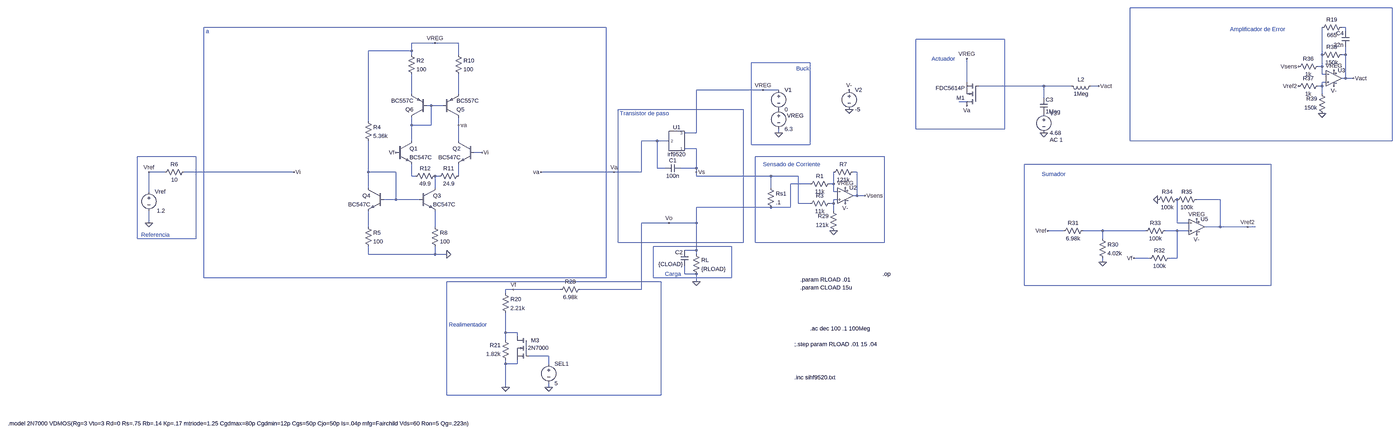
[diagram p0: schematic LDOB_compensadoI.asc, whole sheet]
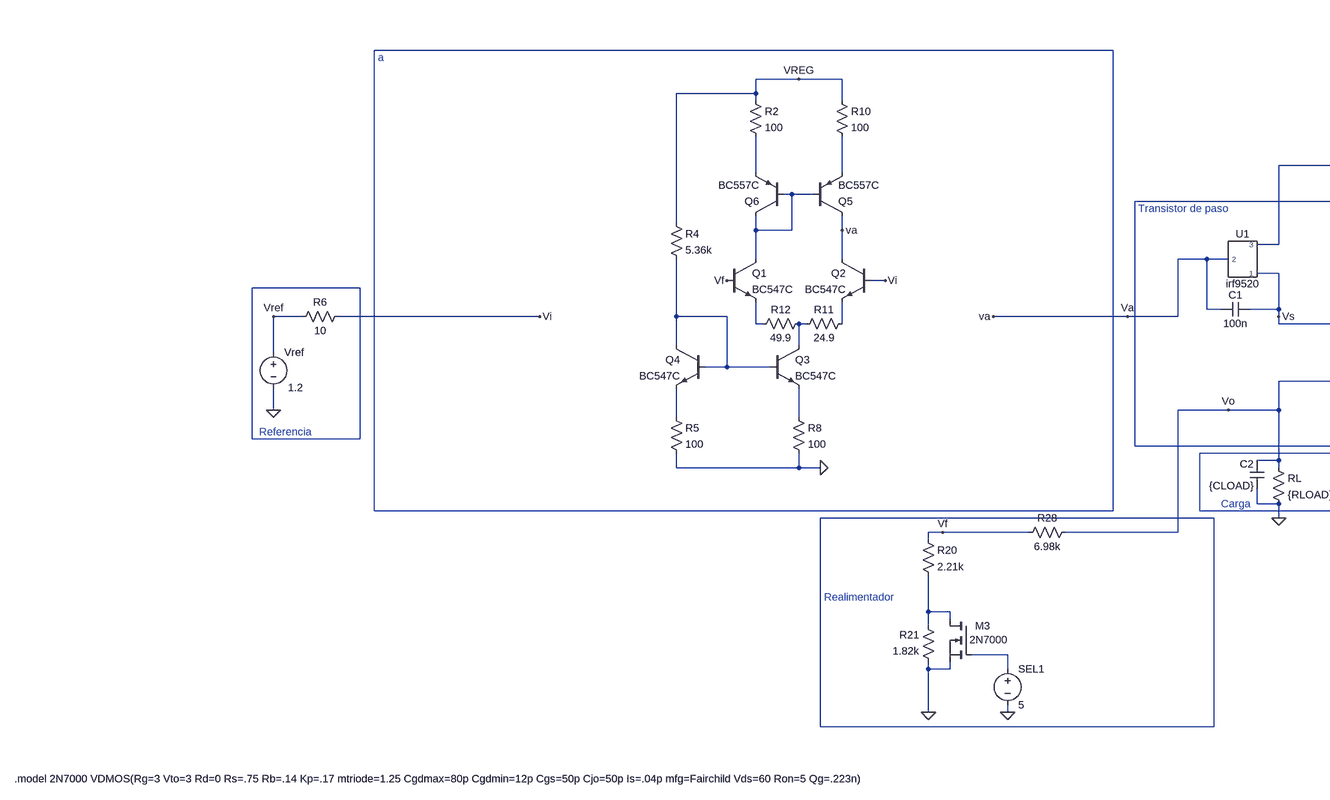
[diagram p1: schematic LDOB_compensadoI.asc, part, row 1 of 1, column 1 of 2]
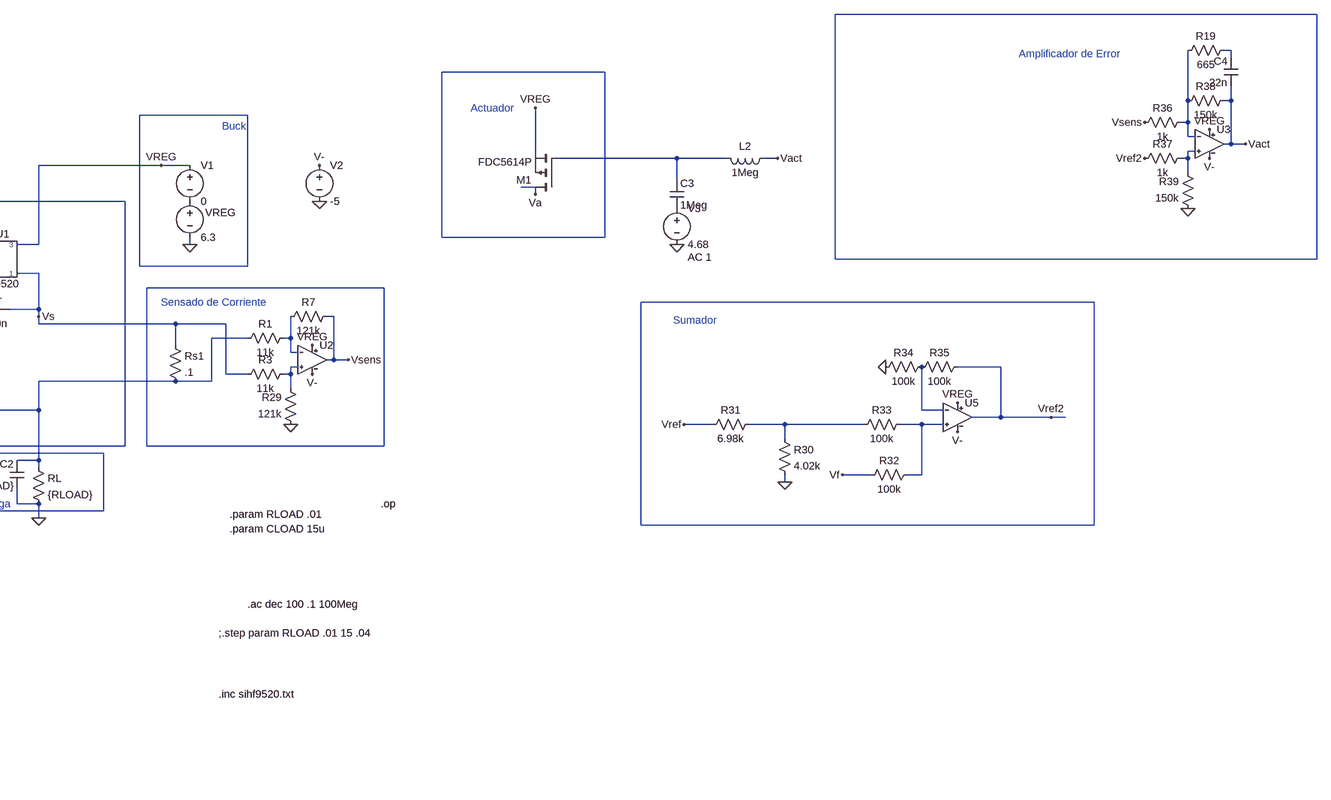
[diagram p2: schematic LDOB_compensadoI.asc, part, row 1 of 1, column 2 of 2]
LDOB_compensadoI.asc, the LTspice schematic file:
Version 4
SHEET 1 26844 1652
WIRE 4848 -560 3504 -560
WIRE 1264 -480 -512 -480
WIRE 4384 -480 4368 -480
WIRE 4384 -464 4384 -480
WIRE 2992 -432 2528 -432
WIRE 432 -416 336 -416
WIRE 528 -416 432 -416
WIRE 336 -384 336 -416
WIRE 336 -384 160 -384
WIRE 336 -368 336 -384
WIRE 528 -368 528 -416
WIRE 4288 -368 4288 -480
WIRE 4384 -368 4384 -400
WIRE 4384 -368 4368 -368
WIRE 2096 -336 1856 -336
WIRE 4288 -320 4288 -368
WIRE 4288 -320 4272 -320
WIRE 4288 -288 4288 -320
WIRE 4304 -288 4288 -288
WIRE 4384 -272 4384 -368
WIRE 4384 -272 4368 -272
WIRE 4416 -272 4384 -272
WIRE 2736 -256 2736 -352
WIRE 4304 -256 4288 -256
WIRE 3152 -240 2784 -240
WIRE 3264 -240 3152 -240
WIRE 3376 -240 3344 -240
WIRE 4288 -240 4288 -256
WIRE 4288 -240 4272 -240
WIRE 1904 -224 1632 -224
WIRE 1968 -224 1904 -224
WIRE 336 -208 336 -288
WIRE 528 -208 528 -288
WIRE 4288 -208 4288 -240
WIRE 3152 -192 3152 -240
WIRE 2736 -176 2704 -176
WIRE 416 -160 400 -160
WIRE 464 -160 416 -160
WIRE 1824 -144 1312 -144
WIRE 160 -96 160 -384
WIRE 336 -80 336 -112
WIRE 416 -80 416 -160
WIRE 416 -80 336 -80
WIRE 528 -80 528 -112
WIRE 2528 -64 2528 -432
WIRE 2992 -64 2992 -432
WIRE 2992 -64 2528 -64
WIRE 1632 -48 1632 -224
WIRE 1632 -48 1584 -48
WIRE 1968 -48 1968 -64
WIRE 336 -16 336 -80
WIRE 528 -16 528 -80
WIRE 1472 -16 1408 -16
WIRE 1520 -16 1472 -16
WIRE 3504 -16 3504 -560
WIRE 4848 -16 4848 -560
WIRE 4848 -16 3504 -16
WIRE 1856 0 1856 -336
WIRE 2096 0 2096 -336
WIRE 2096 0 1856 0
WIRE 1632 16 1584 16
WIRE 624 32 592 32
WIRE -544 48 -784 48
WIRE 2400 48 1872 48
WIRE 4080 80 3072 80
WIRE 1472 96 1472 -16
WIRE 1504 96 1472 96
WIRE 1632 96 1632 16
WIRE 1632 96 1568 96
WIRE -672 112 -736 112
WIRE -144 112 -592 112
WIRE 160 112 160 -16
WIRE 272 112 160 112
WIRE 1296 112 864 112
WIRE 1408 112 1408 -16
WIRE 1408 112 1296 112
WIRE 1632 112 1632 96
WIRE 2288 112 2272 112
WIRE 336 128 336 80
WIRE 352 128 336 128
WIRE 448 128 432 128
WIRE 528 128 528 80
WIRE 1632 128 1632 112
WIRE 1936 128 1632 128
WIRE 2048 128 1936 128
WIRE 2096 160 2016 160
WIRE 2192 160 2192 112
WIRE 2192 160 2176 160
WIRE 160 176 160 112
WIRE 432 176 432 128
WIRE 1936 176 1936 128
WIRE -736 192 -736 112
WIRE 2192 192 2192 160
WIRE 2208 192 2192 192
WIRE 2288 208 2288 112
WIRE 2288 208 2272 208
WIRE 2320 208 2288 208
WIRE 272 224 272 112
WIRE 272 224 224 224
WIRE 368 224 272 224
WIRE 2208 224 2192 224
WIRE 3872 224 3776 224
WIRE 2048 240 2048 128
WIRE 2096 240 2048 240
WIRE 2192 240 2192 224
WIRE 2192 240 2176 240
WIRE 1936 256 1632 256
WIRE 2016 256 2016 160
WIRE 2016 256 1936 256
WIRE 2192 272 2192 240
WIRE -736 320 -736 272
WIRE 1520 320 1408 320
WIRE 1632 320 1632 256
WIRE 1632 320 1520 320
WIRE 3696 320 3696 224
WIRE 3744 320 3696 320
WIRE 160 336 160 272
WIRE 432 336 432 272
WIRE 3872 336 3872 224
WIRE 3872 336 3808 336
WIRE 3984 336 3872 336
WIRE 4016 336 3984 336
WIRE 3232 352 3168 352
WIRE 3392 352 3312 352
WIRE 3568 352 3392 352
WIRE 3696 352 3648 352
WIRE 3744 352 3696 352
WIRE -784 384 -784 48
WIRE -544 384 -544 48
WIRE -544 384 -784 384
WIRE 3392 384 3392 352
WIRE 1312 400 1312 -144
WIRE 1824 400 1824 -144
WIRE 1824 400 1312 400
WIRE 1872 400 1872 48
WIRE 2400 400 2400 48
WIRE 2400 400 1872 400
WIRE 1776 416 1456 416
WIRE 1632 432 1632 320
WIRE 1632 432 1584 432
WIRE 160 448 160 416
WIRE 432 448 432 416
WIRE 432 448 160 448
WIRE 480 448 432 448
WIRE 1632 448 1632 432
WIRE 3584 464 3520 464
WIRE 3696 464 3696 352
WIRE 3696 464 3664 464
WIRE 3392 480 3392 464
WIRE 1584 528 1584 496
WIRE 1632 528 1584 528
WIRE -512 544 -512 -480
WIRE 1264 544 1264 -480
WIRE 1264 544 -512 544
WIRE 1456 544 1456 416
WIRE 1776 544 1776 416
WIRE 1776 544 1456 544
WIRE 1488 560 480 560
WIRE 1632 560 1632 528
WIRE 3072 576 3072 80
WIRE 4080 576 4080 80
WIRE 4080 576 3072 576
WIRE 752 592 720 592
WIRE 944 592 752 592
WIRE 1408 592 1408 320
WIRE 1408 592 1024 592
WIRE 720 608 720 592
WIRE 720 768 720 688
WIRE 768 768 720 768
WIRE 768 784 768 768
WIRE 720 800 720 768
WIRE 896 864 816 864
WIRE 720 896 720 880
WIRE 768 896 768 880
WIRE 768 896 720 896
WIRE 896 896 896 864
WIRE 720 992 720 896
WIRE 896 992 896 976
WIRE 480 1024 480 560
WIRE 1488 1024 1488 560
WIRE 1488 1024 480 1024
FLAG 1632 560 0
FLAG -736 320 0
FLAG 1296 112 Va
FLAG -736 112 Vref
FLAG 1520 320 Vo
FLAG 1968 -48 0
FLAG -144 112 Vi
FLAG 864 112 va
FLAG 1904 -224 VREG
FLAG 2736 -352 VREG
FLAG 3376 -240 Vact
FLAG 2736 -160 Va
FLAG 3152 -48 0
FLAG 1632 112 Vs
FLAG 720 992 0
FLAG 896 992 0
FLAG 2320 208 Vsens
FLAG 2192 352 0
FLAG 3392 480 0
FLAG 3984 336 Vref2
FLAG 3168 352 Vref
FLAG 3520 464 Vf
FLAG 3616 224 0
FLAG 4288 -128 0
FLAG 4416 -272 Vact
FLAG 4192 -240 Vref2
FLAG 4192 -320 Vsens
FLAG 752 592 Vf
FLAG 480 448 0
FLAG 432 -416 VREG
FLAG 528 -80 va
FLAG 624 32 Vi
FLAG 272 32 Vf
FLAG 2240 176 VREG
FLAG 2256 -144 0
FLAG 2256 -224 V-
FLAG 2240 240 V-
FLAG 4336 -304 VREG
FLAG 4336 -240 V-
FLAG 3776 304 VREG
FLAG 3776 368 V-
DATAFLAG 3040 -240 ""
SYMBOL voltage -736 176 R0
WINDOW 123 0 0 Left 0
WINDOW 39 0 0 Left 0
WINDOW 3 66 94 Right 2
SYMATTR Value 1.2
SYMATTR InstName Vref
SYMBOL res 1616 432 R0
SYMATTR InstName RL
SYMATTR Value {RLOAD}
SYMBOL voltage 1968 -160 R0
WINDOW 123 0 0 Left 0
WINDOW 39 0 0 Left 0
WINDOW 0 34 41 Left 2
SYMATTR InstName VREG
SYMATTR Value 6.3
SYMBOL voltage 1968 -240 R0
WINDOW 123 0 0 Left 0
WINDOW 39 0 0 Left 0
SYMATTR InstName V1
SYMATTR Value 0
SYMBOL res -576 96 R90
WINDOW 0 0 56 VBottom 2
WINDOW 3 32 56 VTop 2
SYMATTR InstName R6
SYMATTR Value 10
SYMBOL pmos 2784 -160 R180
SYMATTR InstName M1
SYMATTR Value FDC5614P
SYMBOL cap 1600 496 R180
WINDOW 0 24 56 Left 2
WINDOW 3 24 8 Left 2
SYMATTR InstName C2
SYMATTR Value {CLOAD}
SYMBOL ind 3360 -256 R90
WINDOW 0 5 56 VBottom 2
WINDOW 3 32 56 VTop 2
SYMATTR InstName L2
SYMATTR Value 1Meg
SYMBOL cap 3136 -192 R0
SYMATTR InstName C3
SYMATTR Value 1Meg
SYMBOL voltage 3152 -144 R0
WINDOW 123 24 124 Left 2
WINDOW 39 0 0 Left 0
SYMATTR Value2 AC 1
SYMATTR InstName V3
SYMATTR Value 4.68
SYMBOL cap 1568 80 R90
WINDOW 0 0 32 VBottom 2
WINDOW 3 32 32 VTop 2
SYMATTR InstName C1
SYMATTR Value 100n
SYMBOL res 4272 -464 R270
WINDOW 0 32 56 VTop 2
WINDOW 3 0 56 VBottom 2
SYMATTR InstName R19
SYMATTR Value 665
SYMBOL cap 4400 -400 R180
WINDOW 0 24 56 Left 2
WINDOW 3 24 8 Left 2
SYMATTR InstName C4
SYMATTR Value 22n
SYMBOL res 704 592 R0
SYMATTR InstName R20
SYMATTR Value 2.21k
SYMBOL res 736 896 R180
WINDOW 0 36 76 Left 2
WINDOW 3 36 40 Left 2
SYMATTR InstName R21
SYMATTR Value 1.82k
SYMBOL res 1040 576 R90
WINDOW 0 0 56 VBottom 2
WINDOW 3 32 56 VTop 2
SYMATTR InstName R28
SYMATTR Value 6.98k
SYMBOL voltage 896 880 R0
WINDOW 123 0 0 Left 0
WINDOW 39 0 0 Left 0
SYMATTR InstName SEL1
SYMATTR Value 5
SYMBOL nmos 816 784 M0
WINDOW 0 -42 16 Left 2
WINDOW 3 -80 47 Left 2
SYMATTR InstName M3
SYMATTR Value 2N7000
SYMBOL res 1920 160 R0
SYMATTR InstName Rs1
SYMATTR Value .1
SYMBOL res 2192 144 R90
WINDOW 0 0 56 VBottom 2
WINDOW 3 32 56 VTop 2
SYMATTR InstName R1
SYMATTR Value 11k
SYMBOL res 2192 224 R90
WINDOW 0 0 56 VBottom 2
WINDOW 3 32 56 VTop 2
SYMATTR InstName R3
SYMATTR Value 11k
SYMBOL res 2288 96 R90
WINDOW 0 0 56 VBottom 2
WINDOW 3 32 56 VTop 2
SYMATTR InstName R7
SYMATTR Value 121k
SYMBOL res 2208 368 R180
WINDOW 0 36 76 Left 2
WINDOW 3 36 40 Left 2
SYMATTR InstName R29
SYMATTR Value 121k
SYMBOL res 3376 368 R0
SYMATTR InstName R30
SYMATTR Value 4.02k
SYMBOL res 3328 336 R90
WINDOW 0 0 56 VBottom 2
WINDOW 3 32 56 VTop 2
SYMATTR InstName R31
SYMATTR Value 6.98k
SYMBOL res 3680 448 R90
WINDOW 0 0 56 VBottom 2
WINDOW 3 32 56 VTop 2
SYMATTR InstName R32
SYMATTR Value 100k
SYMBOL res 3664 336 R90
WINDOW 0 0 56 VBottom 2
WINDOW 3 32 56 VTop 2
SYMATTR InstName R33
SYMATTR Value 100k
SYMBOL res 3712 208 R90
WINDOW 0 0 56 VBottom 2
WINDOW 3 32 56 VTop 2
SYMATTR InstName R34
SYMATTR Value 100k
SYMBOL res 3792 208 R90
WINDOW 0 0 56 VBottom 2
WINDOW 3 32 56 VTop 2
SYMATTR InstName R35
SYMATTR Value 100k
SYMBOL res 4288 -336 R90
WINDOW 0 0 56 VBottom 2
WINDOW 3 32 56 VTop 2
SYMATTR InstName R36
SYMATTR Value 1k
SYMBOL res 4288 -256 R90
WINDOW 0 0 56 VBottom 2
WINDOW 3 32 56 VTop 2
SYMATTR InstName R37
SYMATTR Value 1k
SYMBOL res 4384 -384 R90
WINDOW 0 0 56 VBottom 2
WINDOW 3 32 56 VTop 2
SYMATTR InstName R38
SYMATTR Value 150k
SYMBOL res 4304 -112 R180
WINDOW 0 36 76 Left 2
WINDOW 3 36 40 Left 2
SYMATTR InstName R39
SYMATTR Value 150k
SYMBOL npn 272 -16 R0
SYMATTR InstName Q1
SYMATTR Value BC547C
SYMBOL npn 592 -16 M0
SYMATTR InstName Q2
SYMATTR Value BC547C
SYMBOL res 320 -384 R0
SYMATTR InstName R2
SYMATTR Value 100
SYMBOL npn 368 176 R0
SYMATTR InstName Q3
SYMATTR Value BC547C
SYMBOL npn 224 176 M0
SYMATTR InstName Q4
SYMATTR Value BC547C
SYMBOL res 144 -112 R0
SYMATTR InstName R4
SYMATTR Value 5.36k
SYMBOL res 144 320 R0
SYMATTR InstName R5
SYMATTR Value 100
SYMBOL res 416 320 R0
SYMATTR InstName R8
SYMATTR Value 100
SYMBOL res 512 -384 R0
SYMATTR InstName R10
SYMATTR Value 100
SYMBOL pnp 464 -112 M180
SYMATTR InstName Q5
SYMATTR Value BC557C
SYMBOL pnp 400 -112 R180
SYMATTR InstName Q6
SYMATTR Value BC557C
SYMBOL res 544 112 R90
WINDOW 0 0 56 VBottom 2
WINDOW 3 32 56 VTop 2
SYMATTR InstName R11
SYMATTR Value 24.9
SYMBOL res 448 112 R90
WINDOW 0 0 56 VBottom 2
WINDOW 3 32 56 VTop 2
SYMATTR InstName R12
SYMATTR Value 49.9
SYMBOL TL081 2240 208 R0
SYMATTR InstName U2
SYMBOL voltage 2256 -240 R0
WINDOW 123 0 0 Left 0
WINDOW 39 0 0 Left 0
SYMATTR InstName V2
SYMATTR Value -5
SYMBOL TL081 4336 -272 R0
SYMATTR InstName U3
SYMBOL TL081 3776 336 R0
SYMATTR InstName U5
SYMBOL irf9520 1552 -16 R0
SYMATTR InstName U1
TEXT -768 368 Left 2 ;Referencia
TEXT 488 736 Left 2 ;Realimentador
TEXT -504 -464 Left 2 ;a
TEXT 1320 -128 Left 2 ;Transistor de paso
TEXT 1504 528 Left 2 ;Carga
TEXT 2032 816 Left 2 !;.step param RLOAD .01 15 .04
TEXT 2392 528 Left 2 !.op
TEXT 2040 -312 Left 2 ;Buck
TEXT 2032 952 Left 2 !.inc sihf9520.txt
TEXT -1312 1168 Left 2 !.model 2N7000 VDMOS(Rg=3 Vto=3 Rd=0 Rs=.75 Rb=.14 Kp=.17 mtriode=1.25 Cgdmax=80p Cgdmin=12p Cgs=50p Cjo=50p Is=.04p mfg=Fairchild Vds=60 Ron=5 Qg=.223n)
TEXT 2592 -352 Left 2 ;Actuador
TEXT 3912 -472 Left 2 ;Amplificador de Error
TEXT 2096 752 Left 2 !.ac dec 100 .1 100Meg
TEXT 2056 584 Left 2 !.param CLOAD 15u
TEXT 2056 552 Left 2 !.param RLOAD .01
TEXT 3144 120 Left 2 ;Sumador
TEXT 1904 80 Left 2 ;Sensado de Corriente

The netlist it stands for:
* LDOB_compensadoI.asc
Vref Vref 0 1.2
RL Vo 0 {RLOAD}
VREG P001 0 6.3
V1 VREG P001 0
R6 Vi Vref 10
M1 Va N008 VREG VREG FDC5614P
C2 0 Vo {CLOAD}
L2 Vact N008 1Meg
C3 N008 P002 1Meg
V3 P002 0 4.68 AC 1
C1 Vs Va 100n
R19 N005 N003 665
C4 Vact N003 22n
R20 Vf N030 2.21k
R21 0 N030 1.82k
R28 Vo Vf 6.98k
V§SEL1 N031 0 5
M3 N030 N031 0 0 2N7000
Rs1 Vs Vo .1
R1 N021 Vo 11k
R3 N022 Vs 11k
R7 Vsens N021 121k
R29 0 N022 121k
R30 N026 0 4.02k
R31 N026 Vref 6.98k
R32 N027 Vf 100k
R33 N027 N026 100k
R34 N023 0 100k
R35 Vref2 N023 100k
R36 N005 Vsens 1k
R37 N007 Vref2 1k
R38 Vact N005 150k
R39 0 N007 150k
Q1 N012 Vf N018 0 BC547C
Q2 Va Vi N020 0 BC547C
R2 VREG N009 100
Q3 N019 N017 N025 0 BC547C
Q4 N017 N017 N024 0 BC547C
R4 VREG N017 5.36k
R5 N024 0 100
R8 N025 0 100
R10 VREG N010 100
Q5 Va N012 N010 0 BC557C
Q6 N012 N012 N009 0 BC557C
R11 N020 N019 24.9
R12 N019 N018 49.9
XU2 N022 N021 VREG V- Vsens TL081  ; pins In+ In- V+ V- OUT
V2 V- 0 -5
XU3 N007 N005 VREG V- Vact TL081  ; pins In+ In- V+ V- OUT
XU5 N027 N023 VREG V- Vref2 TL081  ; pins In+ In- V+ V- OUT
XU1 Vs Va VREG irf9520  ; pins 1 2 3
.model NPN NPN
.model PNP PNP
.lib standard.bjt
.model NMOS NMOS
.model PMOS PMOS
.lib standard.mos
* Referencia
* Realimentador
* a
* Transistor de paso
* Carga
;.step param RLOAD .01 15 .04
.op
* Buck
.inc sihf9520.txt
.model 2N7000 VDMOS(Rg=3 Vto=3 Rd=0 Rs=.75 Rb=.14 Kp=.17 mtriode=1.25 Cgdmax=80p Cgdmin=12p Cgs=50p Cjo=50p Is=.04p mfg=Fairchild Vds=60 Ron=5 Qg=.223n)
* Actuador
* Amplificador de Error
.ac dec 100 .1 100Meg
.param CLOAD 15u
.param RLOAD .01
* Sumador
* Sensado de Corriente
.lib TL081.301
.lib sihf9520.txt
.backanno
.end